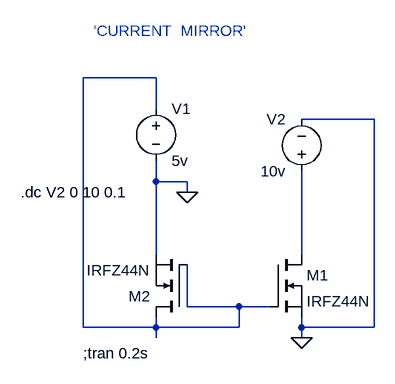
[diagram p0: schematic 9.Current Mirror.asc]
9.Current Mirror.asc, the LTspice schematic file:
Version 4
SHEET 1 880 680
WIRE 32 -176 -80 -176
WIRE 32 -128 32 -176
WIRE 368 -112 256 -112
WIRE 32 -16 32 -48
WIRE 80 -16 32 -16
WIRE 80 0 80 -16
WIRE 32 96 32 -16
WIRE 256 96 256 -32
WIRE 80 176 80 112
WIRE 160 176 80 176
WIRE 208 176 160 176
WIRE -80 208 -80 -176
WIRE 32 208 32 192
WIRE 32 208 -80 208
WIRE 160 208 160 176
WIRE 160 208 32 208
WIRE 256 208 256 192
WIRE 368 208 368 -112
WIRE 368 208 256 208
WIRE 32 224 32 208
WIRE 256 224 256 208
FLAG 256 224 0
FLAG 80 0 0
SYMBOL nmos 208 96 R0
SYMATTR InstName M1
SYMATTR Value IRFZ44N
SYMBOL voltage 256 -16 R180
WINDOW 0 24 96 Left 2
WINDOW 3 24 16 Left 2
WINDOW 123 0 0 Left 0
WINDOW 39 0 0 Left 0
SYMATTR InstName V2
SYMATTR Value 10v
SYMBOL nmos 80 192 R180
SYMATTR InstName M2
SYMATTR Value IRFZ44N
SYMBOL voltage 32 -144 R0
WINDOW 123 0 0 Left 0
WINDOW 39 0 0 Left 0
SYMATTR InstName V1
SYMATTR Value 5v
TEXT -80 248 Left 2 !;tran 0.2s
TEXT -176 0 Left 2 !.dc V2 0 10 0.1
TEXT -64 -248 Left 2 ;'CURRENT  MIRROR'

The netlist it stands for:
* 9.Current Mirror.asc
M1 N002 N001 0 0 IRFZ44N
V2 N002 0 10v
M2 N001 N001 0 0 IRFZ44N
V1 N001 0 5v
.model NMOS NMOS
.model PMOS PMOS
.lib standard.mos
;tran 0.2s
.dc V2 0 10 0.1
* 'CURRENT  MIRROR'
.backanno
.end